# Altium schematic sheet SIM5320  RPi BB.SchDoc
size A4
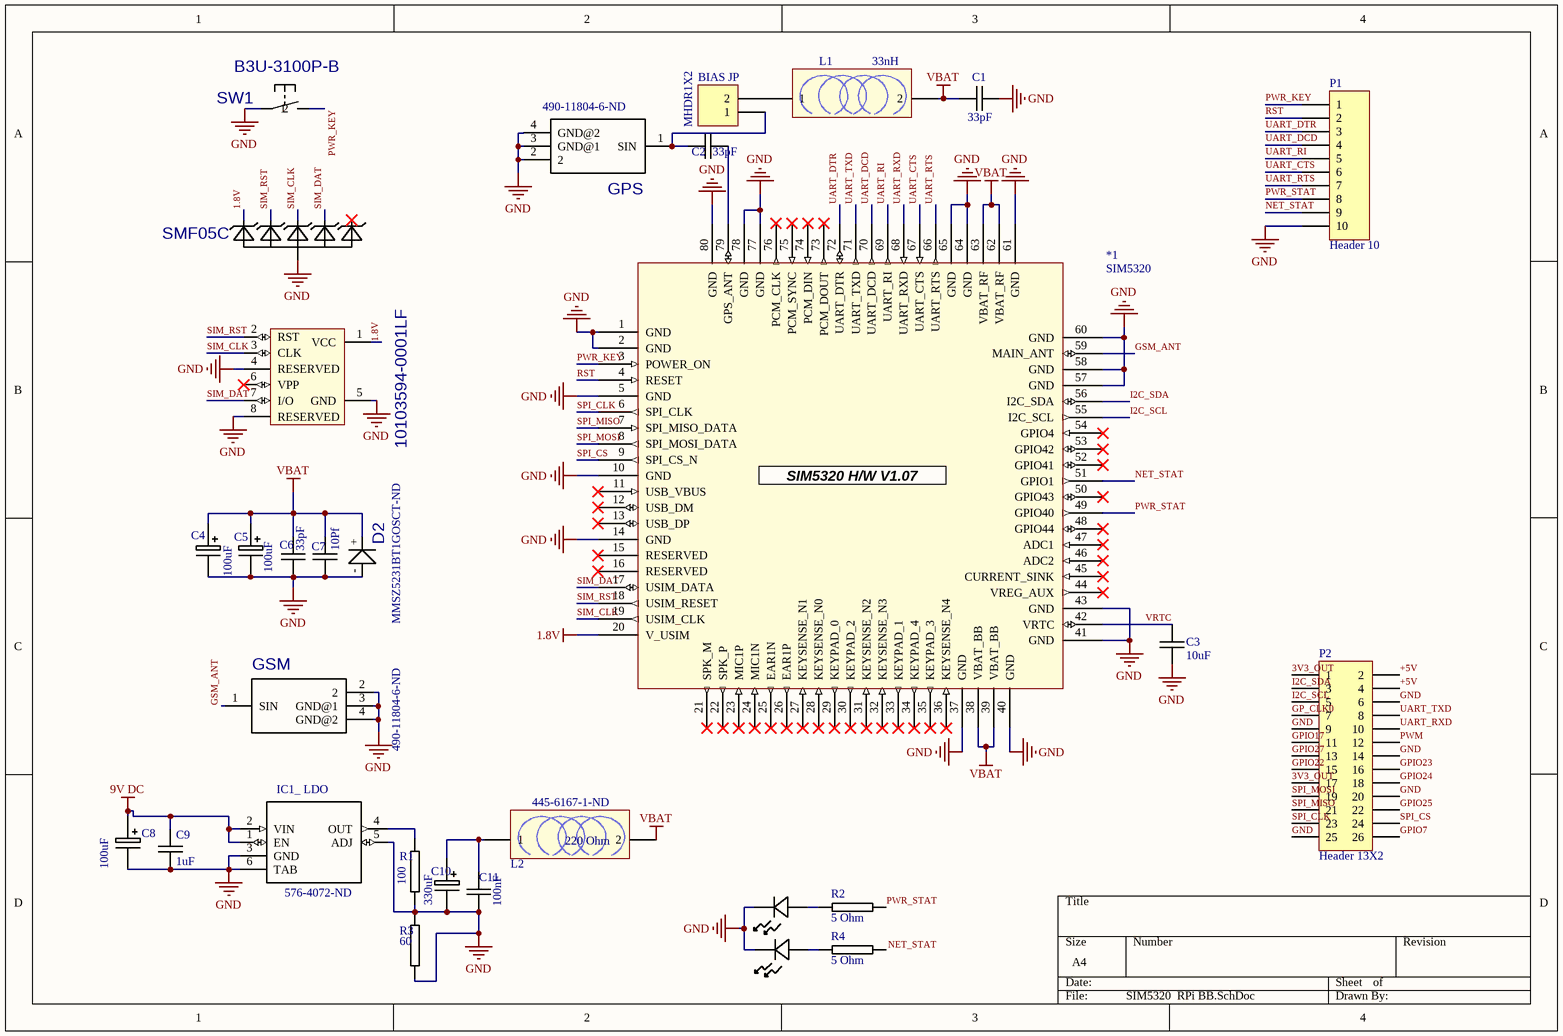
[diagram p0: SIM5320  RPi BB.SchDoc]

## Parts
1  10103594-0001LF  [POS-5]
*1  SIM5320  [SIM5320]
BIAS_JP  MHDR1X2  [MHDR1X2]
C1  33pF  [0805C-TBD]
C2  33pF  [0805C-TBD]
C3  10uF  [0805C-GENERIC]
C4  100uF  [PANACAP-e-GENERIC]
C5  100uF  [PANACAP-e-GENERIC]
C6  33pF  [0805C-TBD]
C7  10Pf  [0805C-TBD]
C8  100uF  [PANACAP-e-GENERIC]
C9  1uF  [0805C-TBD]
C10  330uF  [PANACAP-e-GENERIC]
C11  100nF  [0805C-TBD]
D1  SMF05C  [SC70-6]
D2  MMSZ5231BT1GOSCT-ND  [SOD-123_SMD-DIODE-ZENER-15V-500MW(SOD-123)(Primary)]
GPS  Digi-Key Part Number: 490-11804-6-ND  [MURATA_MM8030-2610RJ3]  (hidden comment: MM8030-2610RJ3)
GSM  Digi-Key Part Number: 490-11804-6-ND  [MURATA_MM8030-2610RJ3]  (hidden comment: MM8030-2610RJ3)
IC1__LDO  Digi-Key Part Number: 576-4072-ND  [TO263-5]  (hidden comment: MIC29302WU)
L1  33nH  [2220]
L2  220 Ohm  Digi-Key Part Number: 445-6167-1-ND  [2220]
LED1  597-3311-402F  [LED_597-3311-402F]  (value not drawn)
LED2  597-3311-402F  [LED_597-3311-402F]  (value not drawn)
P1  Header 10  [HDR1X10]
P2  Header 13X2  [HDR2X13]
R1  100  [0805R-TBD]
R2  5 Ohm  [0805R-TBD]
R3  60  [0805R-TBD]
R4  5 Ohm  [0805R-TBD]
SW1  B3U-3100P-B  [B3U]

## Nets
1.8V: 1.1(VCC) *1.20(V_USIM) D1.1(C1)
9V DC: C8.+ C9.1 IC1__LDO.1(EN) IC1__LDO.2(VIN)
GND: 1.4(RESERVED) 1.5(GND) 1.8(RESERVED) *1.1(GND) *1.2(GND) *1.5(GND) *1.10(GND) *1.14(GND) *1.37(GND) *1.40(GND) *1.41(GND) *1.43(GND) *1.57(GND) *1.58(GND) *1.60(GND) *1.61(GND) *1.64(GND) *1.65(GND) *1.77(GND) *1.78(GND) *1.80(GND) C4.- C5.- C6.2 C7.2 C8.- C9.2 C10.- C11.2 D1.2(A) D2.- GPS.2 GPS.3(GND@1) GPS.4(GND@2) GSM.2 GSM.3(GND@1) GSM.4(GND@2) IC1__LDO.3(GND) IC1__LDO.5(ADJ) IC1__LDO.6(TAB) LED1.1 LED2.1 P1.10 P2.6 P2.9 P2.14 P2.20 P2.25 R1.2 R3.1 R3.2 SW1.1
VBAT: *1.38(VBAT_BB) *1.39(VBAT_BB) *1.62(VBAT_RF) *1.63(VBAT_RF) C1.1 C4.+ C5.+ C6.1 C7.1 D2.+ L1.2 L2.2
3V3_OUT: P2.1 P2.17
+5V: P2.2 P2.4
GP_CLK0: P2.7
GPIO7: P2.26
GPIO17: P2.11
GPIO22: P2.15
GPIO23: P2.16
GPIO24: P2.18
GPIO25: P2.22
GPIO27: P2.13
GSM_ANT: *1.59(MAIN_ANT) GSM.1(SIN)
I2C_SCL: *1.55(I2C_SCL) P2.5
I2C_SDA: *1.56(I2C_SDA) P2.3
NET_STAT: *1.51(GPIO1) P1.9
PWM: P2.12
PWR_KEY: *1.3(POWER_ON) P1.1 SW1.2
PWR_STAT: *1.49(GPIO40) P1.8 R2.1
RST: *1.4(RESET) P1.2
SIM_CLK: 1.3(CLK) *1.19(USIM_CLK) D1.4(C3)
SIM_DAT: 1.7(I/O) *1.17(USIM_DATA) D1.5(C4)
SIM_RST: 1.2(RST) *1.18(USIM_RESET) D1.3(C2)
SPI_CLK: *1.6(SPI_CLK) P2.23
SPI_CS: *1.9(SPI_CS_N) P2.24
SPI_MISO: *1.7(SPI_MISO_DATA) P2.21
SPI_MOSI: *1.8(SPI_MOSI_DATA) P2.19
UART_CTS: *1.67(UART_CTS) P1.6
UART_DCD: *1.70(UART_DCD) P1.4
UART_DTR: *1.72(UART_DTR) P1.3
UART_RI: *1.69(UART_RI) P1.5
UART_RTS: *1.66(UART_RTS) P1.7
UART_RXD: *1.68(UART_RXD) P2.10
UART_TXD: *1.71(UART_TXD) P2.8
VRTC: *1.42(VRTC) C3.1
Net*1_79: *1.79(GPS_ANT) C2.2
NetBIAS_JP_1: BIAS_JP.1 C2.1 GPS.1(SIN)
NetBIAS_JP_2: BIAS_JP.2 L1.1
NetC10_+: C10.+ C11.1 L2.1
NetIC1__LDO_4: IC1__LDO.4(OUT) R1.1
NetLED1_2: LED1.2 R2.2
NetLED2_2: LED2.2 R4.2

Not connected (* = marked no-connect by the designer): 1 6(VPP)*; *1 11(USB_VBUS)* 12(USB_DM)* 13(USB_DP)* 15(RESERVED)* 16(RESERVED)* 21(SPK_M)* 22(SPK_P)* 23(MIC1P)* 24(MIC1N)* 25(EAR1N)* 26(EAR1P)* 27(KEYSENSE_N1)* 28(KEYSENSE_N0)* 29(KEYPAD_0)* 30(KEYPAD_2)* 31(KEYSENSE_N2)* 32(KEYSENSE_N3)* 33(KEYPAD_1)* 34(KEYPAD_4)* 35(KEYPAD_3)* 36(KEYSENSE_N4)* 44(VREG_AUX)* 45(CURRENT_SINK)* 46(ADC2)* 47(ADC1)* 48(GPIO44)* 50(GPIO43)* 52(GPIO41)* 53(GPIO42)* 54(GPIO4)* 73(PCM_DOUT)* 74(PCM_DIN)* 75(PCM_SYNC)* 76(PCM_CLK)*; C1 2; C3 2; D1 6(C5)*; R4 1

## Notes on the sheet
- Labels drawn without touching a wire or pin: GND, NET_STAT
- (in symbol SIM5320) SIM5320 H/W V1.07

## Library data of the parts
1 = 10103594-0001LF: CONN SIM CARD PUSH-PUSH R/A SMD; Manufacturer: Amphenol Commercial Products; Manufacturer Part Number: 101-00306-82; Connector Type: Connector and Ejector; Other Names: 101-00306-82-1; Digi-Key Part Number: 101-00306-82-1-ND; Mounting Type: Surface Mount, Right Angle
BIAS_JP = MHDR1X2: Header, 2-Pin; Manufacturer: Generic Components; Class I: Connector; Revision: July-2002: Re-released for DXP Platform.; Publisher: Altium Limited
C1 C2 C6 C7 C9 C11 = 0805C-TBD: CAPACITOR 0805 CERAMIC VALUE TO BE DETERMINED
C3 = 0805C-10UF-16V-X5R-TDK: CAPACITOR 0805 CERAMIC; Manufacturer Part Number: C2012X5R1C106M; Manufacturer: TDK Corporation; REEL: C63; Supplier 1: Digi-Key; Supplier Part Number 1: 445-4115-2-ND
C4 C5 C8 C10 = PANACAP-100UF-25V-FK: GENERIC CAPACITOR POLARISED; Supplier 1: Digi-Key; Supplier Part Number 1: PCE3408TR-ND
D1 = SMF05C: TVS DIODE 5VWM 12.5VC SC70-6; Manufacturer: Semtech Corporation; Manufacturer Part Number: SMF05C.TCT; Digi-Key Part Number: SMF05CCT-ND; Supplier Device Package: SC-70-6
D2 = SMD-DIODE-ZENER-15V-500MW(SOD-123): DIODE ZENER 5.1V 500MW SOD123; Digi-Key Part Number: MMSZ5231BT1GOSCT-ND; Manufacturer Part Number: MMSZ5231BT1G; Supplier Device Package: SOD-123; Other Names: MMSZ5231BT1GOSCT
GPS GSM = MM8030-2610RJ3: CONN UMC RECEPT SMD; Manufacturer: Murata Electronics North America; Manufacturer Part Number: MM8030-2610RK0; Other Names: 490-11804-6
IC1__LDO = MIC29302WU: IC REG LDO ADJ 3A TO263-5; Manufacturer: Microchip Technology; Manufacturer Part Number: MIC29302AWU; Supplier Device Package: TO-263-5
L1 L2 = HF30ACC575032-T: FERRITE BEAD 270 OHM 2220 1LN; Manufacturer: TDK Corporation; Impedance: @ Frequency 270 Ohm @ 100MHz; Current Rating (Max): 3A; Manufacturer Part Number: HF30ACC575032-T
  L1: Digi-Key Part Number: 445-6167-1-ND; Value: 33nH
  L2: Value: 220 Ohm
P1 = Header 10: Header, 10-Pin; LatestRevisionDate: 17-Jul-2002; LatestRevisionNote: Re-released for DXP Platform.; Publisher: Altium Limited
P2 = Header 13X2: Header, 13-Pin, Dual row; LatestRevisionDate: 17-Jul-2002; LatestRevisionNote: Re-released for DXP Platform.; Publisher: Altium Limited
R1-R4 = 0805R-TBD: RESISTOR 0805 VALUE TO BE DETERMINED
SW1 = B3U-3100: SWITCH TACTILE SPST-NO 0.05A 12V; Digi-Key Part Number: SW1103CT-ND; Manufacturer Part Number: B3U-3100P-B; Circuit: SPST-NO
LED1 LED2 = 597-3311-402F: Value: *